# Altium schematic sheet ZLS-028.SchDoc: GPS Connector Board
size OrCAD A; DocumentNumber: ZLS-028; Revision: B; SheetNumber: 1; SheetTotal: 1; DocumentName: GPS Connector Board
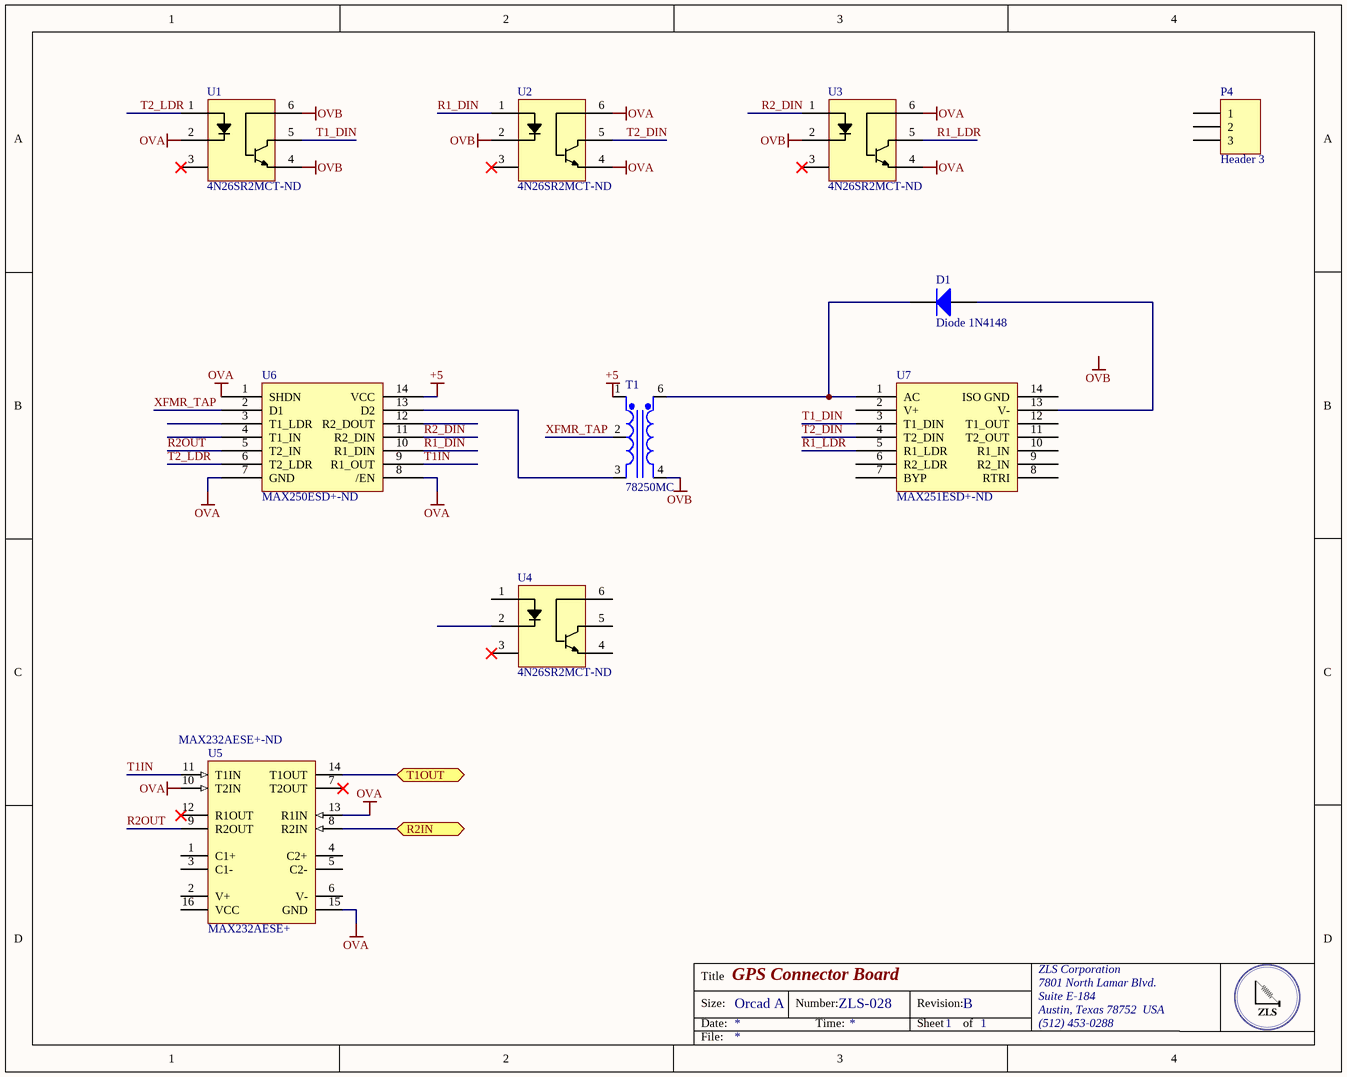
[diagram p0: ZLS-028.SchDoc]

## Parts
D1  Diode 1N4148  [DO-35]
P4  Header 3  [HDR1X3]
T1  78250MC  [78250MC]
U1  Supplier Part Number 1: 4N26SR2MCT-ND  [6-SMD Gull Wing]  (hidden comment: 4N26)
U2  Supplier Part Number 1: 4N26SR2MCT-ND  [6-SMD Gull Wing]  (hidden comment: 4N26)
U3  Supplier Part Number 1: 4N26SR2MCT-ND  [6-SMD Gull Wing]  (hidden comment: 4N26)
U4  Supplier Part Number 1: 4N26SR2MCT-ND  [6-SMD Gull Wing]  (hidden comment: 4N26)
U5  MAX232AESE+  Supplier Part Number 1: MAX232AESE+-ND  [MAXM-S16+5_L]
U6  Supplier Part Number 1: MAX250ESD+-ND  [MAX250ESD+]  (hidden comment: MAX250ESD+)
U7  Supplier Part Number 1: MAX251ESD+-ND  [MAX250ESD+]  (hidden comment: MAX251ESD+)

## Ports
R2IN, T1OUT

## Nets
+5: T1.1(Sec+) U6.14(VCC)
OVA: U1.2 U2.4 U2.6 U3.4 U3.6 U5.10(T2IN) U5.13(R1IN) U5.15(GND) U6.1(SHDN) U6.7(GND) U6.8(/EN)
OVB: T1.4(Pri-) U1.4 U1.6 U2.2 U3.2
R1_DIN: U2.1 U6.10(R1_DIN)
R1_LDR: U3.5 U7.5(R1_LDR)
R2_DIN: U3.1 U6.11(R2_DIN)
R2IN: U5.8(R2IN) ; port R2IN
R2OUT: U5.9(R2OUT) U6.5(T2_IN)
T1_DIN: U1.5 U7.3(T1_DIN)
T1IN: U5.11(T1IN) U6.9(R1_OUT)
T1OUT: U5.14(T1OUT) ; port T1OUT
T2_DIN: U2.5 U7.4(T2_DIN)
T2_LDR: U1.1 U6.6(T2_LDR)
XFMR_TAP: T1.2(PriCT) U6.2(D1)
NetD1_1: D1.1(A) U7.13(V-)
NetD1_2: D1.2(K) T1.6(Pri+) U7.1(AC)
NetT1_3: T1.3(Sec-) U6.13(D2)

Not connected (* = marked no-connect by the designer): P4 1 2 3; U1 3*; U2 3*; U3 3*; U4 1 2 3* 4 5 6; U5 1(C1+) 2(V+) 3(C1-) 4(C2+) 5(C2-) 6(V-) 7(T2OUT)* 12(R1OUT)* 16(VCC); U6 3(T1_LDR) 4(T1_IN) 12(R2_DOUT); U7 2(V+) 6(R2_LDR) 7(BYP) 8(RTRI) 9(R2_IN) 10(R1_IN) 11(T2_OUT) 12(T1_OUT) 14(ISO_GND)

## Notes on the sheet
- Labels drawn without touching a wire or pin: OVB
- Title
- Size:
- Date:
- Orcad A
- Number:
- Time:
- Revision:
- Sheet
- of
- ZLS Corporation
- 7801 North Lamar Blvd.
- Suite E-184
- Austin, Texas 78752  USA
- (512) 453-0288
- File:

## Library data of the parts
D1 = Diode 1N4148: High Conductance Fast Diode; Published: 8-Jun-2000; LatestRevisionDate: 17-Jul-2002; LatestRevisionNote: Re-released for DXP Platform.; DatasheetVersion: 1997; PackageReference: DO-35; Publisher: Altium Limited; PackageDescription: Diode, Axial; Body 3.8 x 1.9 mm (LxDia. max), Lead Dia. 0.53 mm (max); Code_JEDEC: DO-204-AH; ComponentLink1Description: Manufacturer Link; ComponentLink1URL: http://www.fairchildsemi.com/; ComponentLink2Description: Datasheet; ComponentLink2URL: http://www.fairchildsemi.com/ds/1N%2F1N4148.pdf
P4 = Header 3: Header, 3-Pin; LatestRevisionDate: 17-Jul-2002; LatestRevisionNote: Re-released for DXP Platform.; Publisher: Altium Limited
T1 = Trans CT: Center-Tapped Transformer; Manufacturer: Murata Power Solutions Inc.; For Use With/Related Products: MAX250, MAX251; Supplier 1: Digi-Key; Supplier Part Number 1: 811-1276-5-ND; Manufacturer Part Number: 78250MC; RoHS: RoHS Compliant; Category: Transformers; Stock 1: 1545; Pricing 1: 1=2.66, 5=2.64, 10=2.62, 25=2.59, 50=2.52, 100=2.41, 250=2.24, 500=2.1, 1000=2.0881 (USD); Part Status: Active; Mounting Type: Surface Mount; Size / Dimension: 0.354" L x 0.375" W (9.00mm x 9.52mm); Height - Seated (Max): 0.260" (6.60mm); Weight: 0.04 oz (1.14g); ComponentLink1URL: http://www.murata-ps.com/data/magnetics/kmp_78250.pdf; ComponentLink1Description: http://www.murata-ps.com/data/magnetics/kmp_78250.pdf
U1-U4 = 4N26: Manufacturer: ON Semiconductor; Manufacturer Part Number: 4N26SR2M; Description: OPTOISO 4.17KV TRANS W/BASE 6SMD; Voltage - Isolation: 4170Vrms; Current Transfer Ratio (Min): 20% @ 10mA; Turn On / Turn Off Time (Typ): 2µs, 2µs; Input Type: DC; Output Type: Transistor with Base; Voltage - Output (Max): 30V; Voltage - Forward (Vf) (Typ): 1.18V; Vce Saturation (Max): 500mV; Supplier 1: Digi-Key; RoHS: RoHS Compliant; Category: Isolators; Stock 1: 2956; Pricing 1: 1=0.7, 10=0.546, 100=0.3918, 500=0.30084 (USD); Packaging: Cut Tape (CT); Part Status: Active; Current Transfer Ratio (Max): -; Rise / Fall Time (Typ): -; Current - Output / Channel: -; Operating Temperature: -40°C ~ 100°C; Mounting Type: Surface Mount; Package / Case: 6-SMD, Gull Wing; Supplier Device Package: 6-SMD; ComponentLink1URL: https://www.fairchildsemi.com/datasheets/4N/4N25M.pdf; ComponentLink1Description: https://www.fairchildsemi.com/datasheets/4N/4N25M.pdf
U5 = CMP-1675-00002-1: IC TXRX 2/2 FULL RS232 16SOIC; Manufacturer: Maxim Integrated; Data Rate: 200kbps; Voltage - Supply: 4.5 V ~ 5.5 V; Supplier 1: Digi-Key; Manufacturer Part Number: MAX232AESE+; RoHS: RoHS Compliant; Category: Integrated Circuits (ICs); Stock 1: 1445; Pricing 1: 1=4.85, 10=4.608, 25=4.3, 50=4.223 (USD); Packaging: Tube; Part Status: Active; Type: Transceiver; Protocol: RS232; Number of Drivers/Receivers: 2/2; Duplex: Full; Operating Temperature: -40°C ~ 85°C; Mounting Type: Surface Mount; Package / Case: 16-SOIC (0.154", 3.90mm Width); Supplier Device Package: 16-SOIC; ComponentLink1URL: https://datasheets.maximintegrated.com/en/ds/MAX220-MAX249.pdf; ComponentLink1Description: https://datasheets.maximintegrated.com/en/ds/MAX220-MAX249.pdf
U7 = MAX251ESD+: Manufacturer: Maxim Integrated; Protocol: RS232; Number of Drivers/Receivers: 2/2; Duplex: Full; Voltage - Supply: 4.5 V ~ 5.5 V; Supplier 1: Digi-Key; Manufacturer Part Number: MAX251ESD+; RoHS: RoHS Compliant; Category: Integrated Circuits (ICs); Stock 1: 70; Pricing 1: 1=7.66, 10=7.277, 25=6.79, 50=6.6714 (USD); Packaging: Tube; Part Status: Active; Type: Transceiver; Data Rate: -; Operating Temperature: -40°C ~ 85°C; Mounting Type: Surface Mount; Package / Case: 14-SOIC (0.154", 3.90mm Width); Supplier Device Package: 14-SOIC; ComponentLink1URL: http://datasheets.maximintegrated.com/en/ds/MAX250-MAX251.pdf; ComponentLink1Description: http://datasheets.maximintegrated.com/en/ds/MAX250-MAX251.pdf
U6 = MAX250ESD+: Supplier 1: Digi-Key